# Altium schematic sheet Patil_Sheet_1_20181208.SchDoc: LED DRIVER SCHEMATIC
size B; Date: 22 OCT 2018; DrawnBy: CHINMAY PATIL; Engineer: CHINMAY PATIL; Revision: 3; SheetNumber: 1; SheetTotal: 2
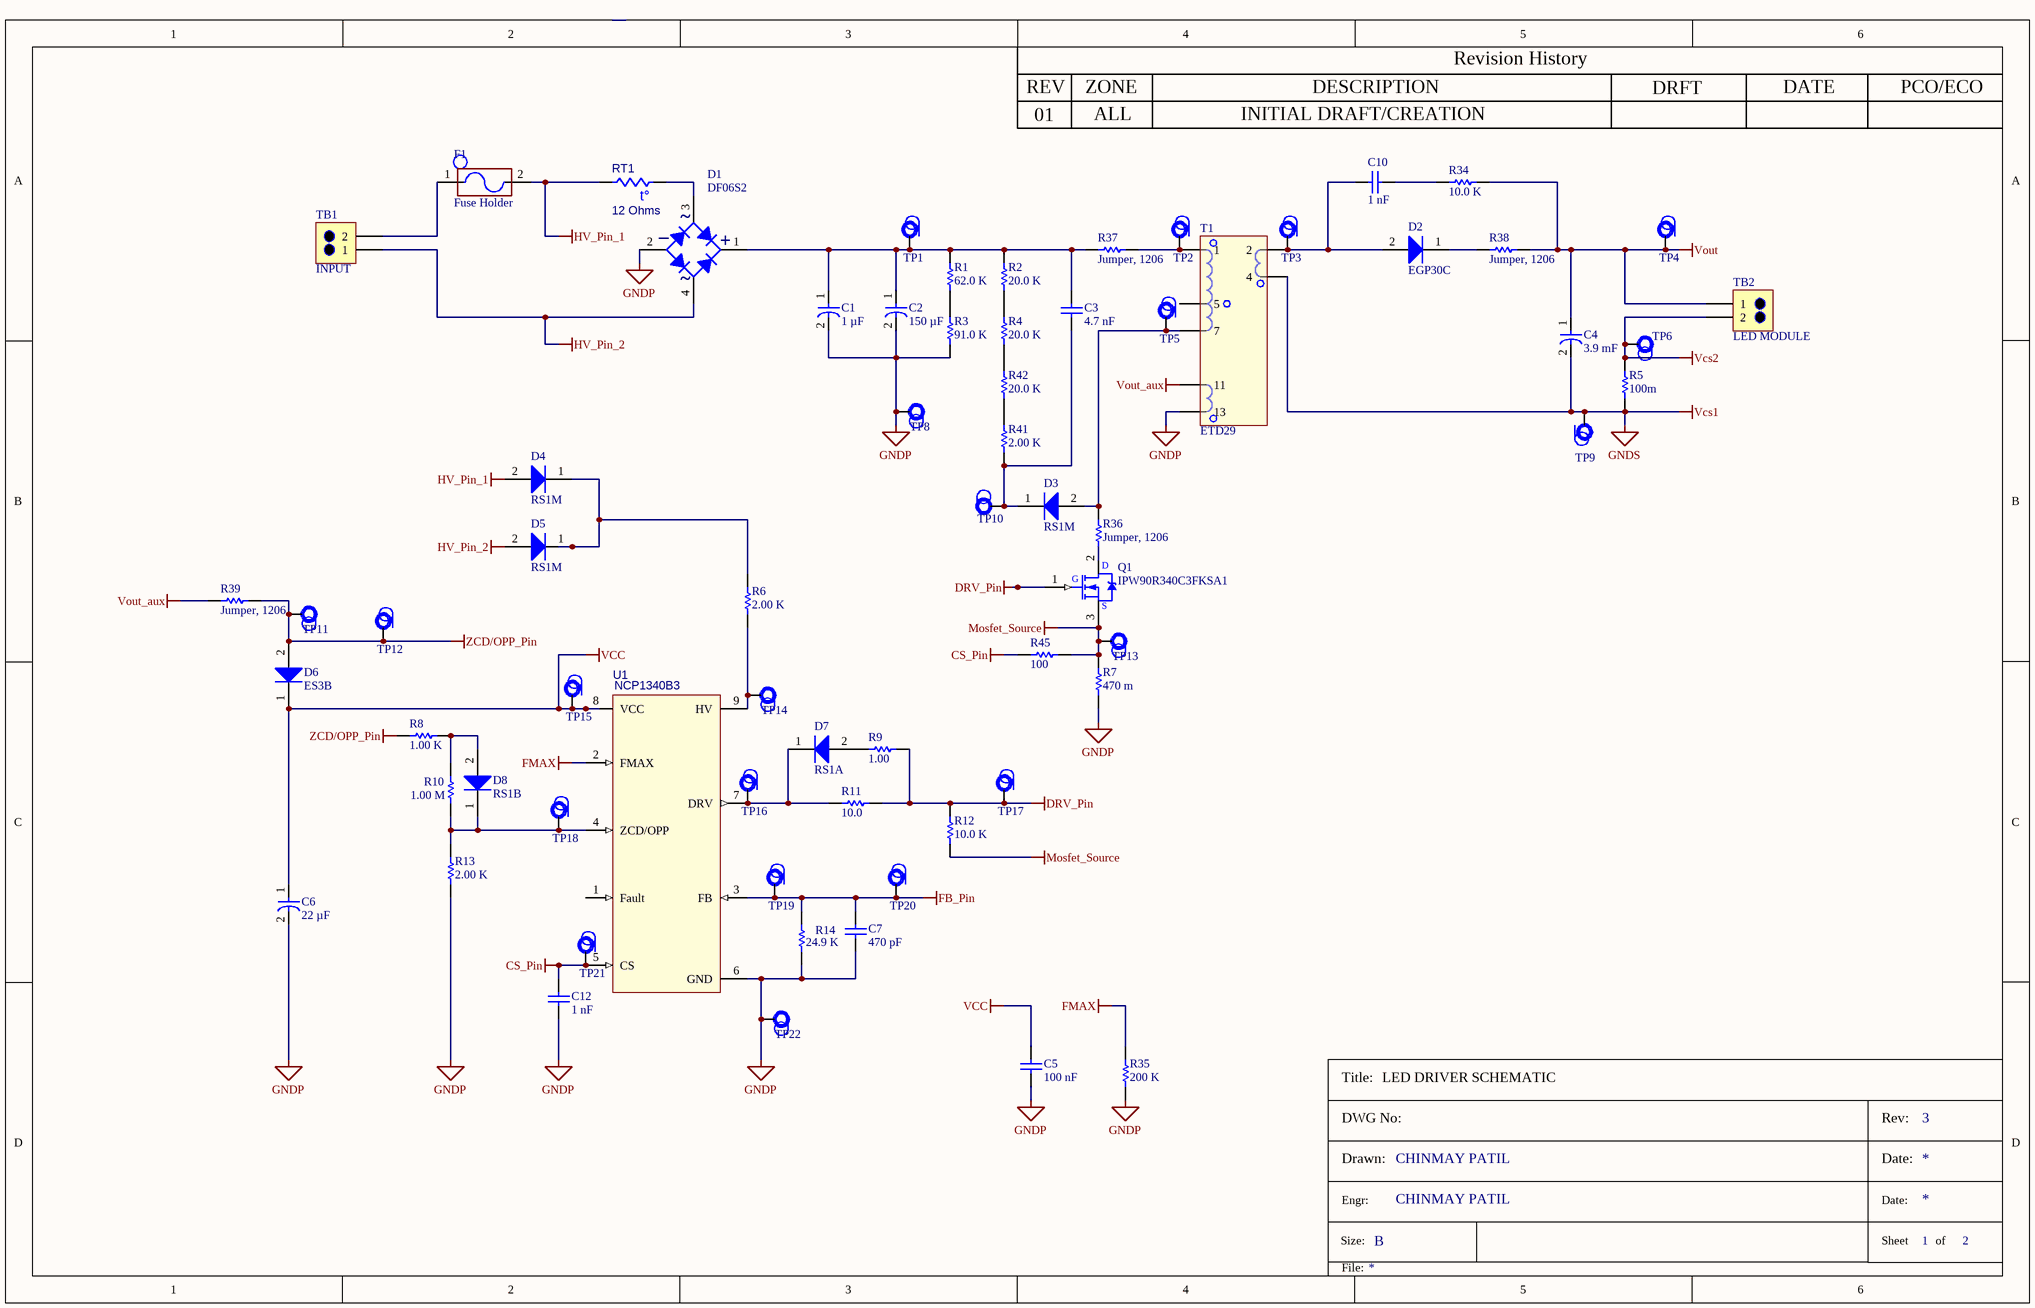
[diagram p0: Patil_Sheet_1_20181208.SchDoc]

## Parts
C1  1 µF  [CAP-RAD-THRU-L17.5 X W7.8 X LS15.0 X H11.0MM]
C2  150 µF  [CAP-SNAP_D25 X H35MM_A35]
C3  4.7 nF  [CAP-1210M_IPC]
C4  3.9 mF  [CAP-RAD-THRU-D18.0 X LS7.5 X H40.0MM]
C5  100 nF  [CAP-0805M_IPC]
C6  22 µF  [CAPAE660X540M_CASE-D_IPC]
C7  470 pF  [CAP-0805M_IPC]
C10  1 nF  [CAP-1210M_IPC]
C12  1 nF  [CAP-0805M_IPC]
D1  DF06S2  [SOIC510P1040X260-4M_IPC]
D2  EGP30C  [DIO-AXIAL-DO-201AD]
D3  RS1M  [DIODE-SMA-DO214AC]
D4  RS1M  [DIODE-SMA-DO214AC]
D5  RS1M  [DIODE-SMA-DO214AC]
D6  ES3B  [DIODE-SMC-DO214AB]
D7  RS1A  [DIODE-SMA-DO214AC]
D8  RS1B  [DIODE-SMA-DO214AC]
F1  Fuse Holder  [FUSE_HOLDER_3AG_4527]
Q1  IPW90R340C3FKSA1  [TO546P508X1588X2483-3A_IPC]
R1  62.0 K  [RES-AXIAL-2W_IPC]
R2  20.0 K  [RES-2512M_IPC]
R3  91.0 K  [RES-AXIAL-2W_IPC]
R4  20.0 K  [RES-2512M_IPC]
R5  100m  [RES-2512M_IPC]
R6  2.00 K  [RES-AXIAL-2W_IPC]
R7  470 m  [RES-2512M_IPC]
R8  1.00 K  [RES-2512M_IPC]
R9  1.00  [RES-0805M_IPC]
R10  1.00 M  [RES-1206M_IPC]
R11  10.0  [RES-0805M_IPC]
R12  10.0 K  [RES-1206M_IPC]
R13  2.00 K  [RES-2512M_IPC]
R14  24.9 K  [RES-1206M_IPC]
R34  10.0 K  [RES-2512M_IPC]
R35  200 K  [RES-1206M_IPC]
R36  Jumper, 1206  [RES-1206M_IPC]
R37  Jumper, 1206  [RES-1206M_IPC]
R38  Jumper, 1206  [RES-1206M_IPC]
R39  Jumper, 1206  [RES-1206M_IPC]
R41  2.00 K  [RES-2512M_IPC]
R42  20.0 K  [RES-2512M_IPC]
R45  100  [RES-0805M_IPC]
RT1  12 Ohms  [THERM-RADIAL-15.5MM_DIA_X6MM_THK]
T1  ETD29  [TRANS508P3530X3520X2500-13A_IPC]
TB1  INPUT  [CONN_2-POS_TERMINAL_BLOCK_1729128]
TB2  LED MODULE  [CONN_2-POS_TERMINAL_BLOCK_1729128]
TP1  Test Point  [TP_SMT_LOOP-5019_3D]  (value not drawn)
TP2  Test Point  [TP_SMT_LOOP-5019_3D]  (value not drawn)
TP3  Test Point  [TP_SMT_LOOP-5019_3D]  (value not drawn)
TP4  Test Point  [TP_SMT_LOOP-5019_3D]  (value not drawn)
TP5  Test Point  [TP_SMT_LOOP-5019_3D]  (value not drawn)
TP6  Test Point  [TP_SMT_LOOP-5019_3D]  (value not drawn)
TP8  Test Point  [TP_SMT_LOOP-5019_3D]  (value not drawn)
TP9  Test Point  [TP_SMT_LOOP-5019_3D]  (value not drawn)
TP10  Test Point  [TP_SMT_LOOP-5019_3D]  (value not drawn)
TP11  Test Point  [TP_SMT_LOOP-5019_3D]  (value not drawn)
TP12  Test Point  [TP_SMT_LOOP-5019_3D]  (value not drawn)
TP13  Test Point  [TP_SMT_LOOP-5019_3D]  (value not drawn)
TP14  Test Point  [TP_SMT_LOOP-5019_3D]  (value not drawn)
TP15  Test Point  [TP_SMT_LOOP-5019_3D]  (value not drawn)
TP16  Test Point  [TP_SMT_LOOP-5019_3D]  (value not drawn)
TP17  Test Point  [TP_SMT_LOOP-5019_3D]  (value not drawn)
TP18  Test Point  [TP_SMT_LOOP-5019_3D]  (value not drawn)
TP19  Test Point  [TP_SMT_LOOP-5019_3D]  (value not drawn)
TP20  Test Point  [TP_SMT_LOOP-5019_3D]  (value not drawn)
TP21  Test Point  [TP_SMT_LOOP-5019_3D]  (value not drawn)
TP22  Test Point  [TP_SMT_LOOP-5019_3D]  (value not drawn)
U1  NCP1340B3  [SOIC100P600X175-9M]

## Nets
CS_Pin: C12.2 R45.1 TP21.1(GND_TP) U1.5(CS)
DRV_Pin: Q1.1(GATE) R9.2 R11.2 R12.2 TP17.1(GND_TP)
FB_Pin: C7.2 R14.2 TP19.1(GND_TP) TP20.1(GND_TP) U1.3(FB)
FMAX: R35.2 U1.2(FMAX)
GNDP: C1.2(Cathode) C2.2(Cathode) C5.1 C6.2(Cathode) C7.1 C12.1 D1.2(A) R3.1 R7.1 R13.1 R14.1 R35.1 T1.13 TP8.1(GND_TP) TP22.1(GND_TP) U1.6(GND)
GNDS: C4.2(Cathode) R5.1 T1.4 TP9.1(GND_TP)  [also labelled Vcs1]
HV_Pin_1: D4.2(K) F1.2 RT1.2
HV_Pin_2: D1.4(C) D5.2(K) TB1.1
Mosfet_Source: Q1.3(SOURCE) R7.2 R12.1 R45.2 TP13.1(GND_TP)
VCC: C5.2 C6.1(Anode) D6.1(A) TP15.1(GND_TP) U1.8(VCC)
Vcs2: R5.2 TB2.2 TP6.1(GND_TP)
Vout: C4.1(Anode) R34.2 R38.1 TB2.1 TP4.1(GND_TP)
Vout_aux: R39.2 T1.11
ZCD/OPP_Pin: D6.2(K) R8.1 R39.1 TP11.1(GND_TP) TP12.1(GND_TP)
NetC1_1: C1.1(Anode) C2.1(Anode) C3.2 D1.1(K) R1.2 R2.2 R37.2 TP1.1(GND_TP)
NetC3_1: C3.1 D3.1(A) R41.1 TP10.1(GND_TP)
NetC10_1: C10.1 D2.2(K) T1.2 TP3.1(GND_TP)
NetC10_2: C10.2 R34.1
NetD1_3: D1.3(C) RT1.1
NetD2_1: D2.1(A) R38.2
NetD3_2: D3.2(K) R36.2 T1.7 TP5.1(GND_TP)
NetD4_1: D4.1(A) D5.1(A) R6.2
NetD7_1: D7.1(A) R11.1 TP16.1(GND_TP) U1.7(DRV)
NetD7_2: D7.2(K) R9.1
NetD8_1: D8.1(A) R10.2 R13.2 TP18.1(GND_TP) U1.4(ZCD/OPP)
NetD8_2: D8.2(K) R8.2 R10.1
NetF1_1: F1.1 TB1.2
NetQ1_2: Q1.2(DRAIN) R36.1
NetR1_1: R1.1 R3.2
NetR2_1: R2.1 R4.2
NetR4_1: R4.1 R42.2
NetR6_1: R6.1 TP14.1(GND_TP) U1.9(HV)
NetR37_1: R37.1 T1.1 TP2.1(GND_TP)
NetR41_2: R41.2 R42.1

Not connected (* = marked no-connect by the designer): T1 5; U1 1(Fault)

## Notes on the sheet
- REV
- ZONE
- DESCRIPTION
- Revision History
- DRFT
- DATE
- PCO/ECO
- 01
- ALL
- INITIAL DRAFT/CREATION
- Title:
- DWG No:
- Rev:
- Drawn:
- Date:
- Size:
- Engr:
- B
- Sheet
- of
- File:
- (in symbol 10-0016-002) D; G; S
- (in symbol 13-0015-001) ~; _; +
- (in symbol 15-0010-003) t°

## Library data of the parts
C1 = 16-0009-002: Capacitor, Film, 1 µF, ±5%, 450 V, Metallized Polypropylene, Radial, Lead; Manufacturer: Panasonic; Manufacturer Part Number: ECW-FD2W105J; Rated Voltage (V): 450 V; Distributor: Digi-Key; Distributor Part Number: PCF1616-ND; Package: Radial, Lead; TempCo: Metallized Polypropylene; Tolerance: ±5%; Type: Capacitor, Film; Value: 1 µF
C2 = 16-0003-003: Capacitor, Al. El., 150 µF, ±20%, 450 V, Radial, Snap; Manufacturer: Nichicon; Manufacturer Part Number: LKX2W151MESA35; Notes: A35 size; Rated Voltage (V): 450 V; Distributor: Digi-Key; Distributor Part Number: 493-17561-ND; Package: Radial, Snap; Tolerance: ±20%; Type: Capacitor, Al. El.; Value: 150 µF
C3 = 16-0010-003: Capacitor, Ceramic, 4.7 nF, ±10%, 1000 V, X7R, 1210; Manufacturer: Vishay Vitramon; Manufacturer Part Number: VJ1210Y472KXGAT5Z; Rated Voltage (V): 1000 V; Value: 4.7 nF; Tolerance: ±10%; Package: 1210; Type: Capacitor, Ceramic; TempCo: X7R; Distributor: Digi-Key; Distributor Part Number: 720-1057-1-ND
C4 = 16-0006-007: Capacitor, Al. El., 3.9 mF, ±20%, 35 V, Radial, Lead; Manufacturer: Nichicon; Manufacturer Part Number: UHE1V392MHD; Rated Voltage (V): 35 V; Distributor: Digi-Key; Distributor Part Number: 493-1602-ND; Package: Radial, Lead; Tolerance: ±20%; Type: Capacitor, Al. El.; Value: 3.9 mF
C5 = 16-0001-066: Capacitor, Ceramic, 100 nF, ±10%, 50 V, X7R, 0805; Manufacturer: TDK; Manufacturer Part Number: C2012X7R1H104KT; Rated Voltage (V): 50 V; Value: 100 nF; Tolerance: ±10%; Package: 0805; Type: Capacitor, Ceramic; TempCo: X7R; Distributor: Lab Stock; Distributor Part Number: 16-0001-066
C6 = 16-0005-007: Capacitor, Al. El., 22 µF, ±20%, 35 V, SMT; Manufacturer: Panasonic; Manufacturer Part Number: EEEFC1V220P; Notes: FC "D" Size; Rated Voltage (V): 35 V; Distributor: Digi-Key; Distributor Part Number: PCE4025CT-ND; Package: SMT; Tolerance: ±20%; Type: Capacitor, Al. El.; Value: 22 µF
C7 = 16-0001-038: Capacitor, Ceramic, 470 pF, ±5%, 50 V, NP0, 0805; Manufacturer: TDK; Manufacturer Part Number: C2012C0G1H471JT; Rated Voltage (V): 50 V; Value: 470 pF; Tolerance: ±5%; Package: 0805; Type: Capacitor, Ceramic; TempCo: NP0; Distributor: Lab Stock; Distributor Part Number: 16-0001-038
C10 = 16-0010-001: Capacitor, Ceramic, 1 nF, ±10%, 1000 V, X7R, 1210; Manufacturer: Vishay Vitramon; Manufacturer Part Number: VJ1210Y102KXGAT5Z; Rated Voltage (V): 1000 V; Value: 1 nF; Tolerance: ±10%; Package: 1210; Type: Capacitor, Ceramic; TempCo: X7R; Distributor: Digi-Key; Distributor Part Number: 720-1045-1-ND
C12 = 16-0001-042: Capacitor, Ceramic, 1 nF, ±5%, 50 V, NP0, 0805; Manufacturer: TDK; Manufacturer Part Number: C2012C0G1H102JT; Rated Voltage (V): 50 V; Value: 1 nF; Tolerance: ±5%; Package: 0805; Type: Capacitor, Ceramic; TempCo: NP0; Distributor: Lab Stock; Distributor Part Number: 16-0001-042
D1 = 13-0015-001: Diode, Bridge, Std Recovery, DF06S2, 600 V, 2 A, SDIP-4; Manufacturer: ON Semi; I or P: 2 A; Type: Diode, Schottky; V (max): 600 V; Distributor: Digi-Key; Distributor Part Number: DF06S2CT-ND; Manufacturer Part Number: DF06S2; Package: SDIP-4; Industry Number: DF06S2
D2 = 13-0023-001: Diode, Fast Recovery, EGP30C, 150 V, 3 A, DO-201AD; Manufacturer: ON Semi; I or P: 3 A; V (max): 150 V; Distributor: Digi-Key; Distributor Part Number: EGP30CCT-ND; Manufacturer Part Number: EGP30C; Package: DO-201AD, Axial; Industry Number: EGP30C; Type: Diode, Fast Recovery
D3-D5 = 13-0001-007: Diode, Fast Recovery, RS1M, 1000 V, 1 A, SMA; Manufacturer: ON Semi; I or P: 1 A; V (max): 1000 V; Distributor: Digi-Key; Distributor Part Number: RS1MFSCT-ND; Manufacturer Part Number: RS1M; Package: SMA; Industry Number: RS1M; Type: Diode, Fast Recovery
D6 = 13-0026-002: Diode, Fast Recovery, ES3B, 100 V, 3 A, SMC; Manufacturer: ON Semiconductor; I or P: 3 A; V (max): 100 V; Distributor: Digi-Key; Distributor Part Number: ES3BFSCT-ND; Manufacturer Part Number: ES3B; Package: SMC; Industry Number: ES3B; Type: Diode, Fast Recovery
D7 = 13-0001-001: Diode, Fast Recovery, RS1A, 50 V, 1 A, SMA; Manufacturer: ON Semi; I or P: 1 A; V (max): 50 V; Distributor: Digi-Key; Distributor Part Number: RS1ACT-ND; Manufacturer Part Number: RS1A; Package: SMA; Industry Number: RS1A; Type: Diode, Fast Recovery
D8 = 13-0001-002: Diode, Fast Recovery, RS1B, 100 V, 1 A, SMA; Manufacturer: ON Semi; I or P: 1 A; V (max): 100 V; Distributor: Digi-Key; Distributor Part Number: RS1BFSCT-ND; Manufacturer Part Number: RS1B; Package: SMA; Industry Number: RS1B; Type: Diode, Fast Recovery
F1 = 18-0012-001: Fuse Holder, TH, 5mm, 3AG; Manufacturer: Keystone Electronics; Manufacturer Part Number: 4527; Package: TH; Industry Name: Fuse Holder; Type: 5mm; Mounting Type: 3AG; Distributor: Digi-Key; Distributor Part Number: 36-4527-ND
Q1 = 10-0016-002: MOSFET, N-Channel, IPW90R340C3FKSA1, 900 V, 340 mOhm, TO-247; Manufacturer: Infineon; Vce/ds (max): 900 V; Current/ Resistance Description: 340 mOhm; Distributor: Digi-Key; Distributor Part Number: IPW90R340C3FKSA1-ND; Industry Number: IPW90R340C3FKSA1; Mfr Part Number: IPW90R340C3FKSA1; Package: TO-247; Notes: *; Polarity: N-Channel; Type: MOSFET
R1 = 15-0005-124: Resistor, TH, 62.0 K, 5%, 2 W, MO, Axial; Manufacturer: Yageo; Manufacturer Part Number: RSF200JB-73-62K; Rated Power (W): 2 W; Composition: MO; Distributor: Digi-Key; Distributor Part Number: 62KW-2-ND; Package: Axial; Tolerance: 5%; Type: Resistor, TH; Value: 62.0 K
R2 R4 R42 = 15-0004-129: Resistor, SMT, 20.0 K, 5%, 1 W, 2512; Rated Power (W): 1 W; Distributor: Lab Stock; Distributor Part Number: 15-0004-129; Package: 2512; Tolerance: 5%; Type: Resistor, SMT; Value: 20.0 K
R3 = 15-0005-128: Resistor, TH, 91.0 K, 5%, 2 W, MO, Axial; Manufacturer: Yageo; Manufacturer Part Number: RSF200JB-73-91K; Rated Power (W): 2 W; Composition: MO; Distributor: Digi-Key; Distributor Part Number: 91KW-2-ND; Package: Axial; Tolerance: 5%; Type: Resistor, TH; Value: 91.0 K
R5 = 15-0012-001: Resistor, SMT, 100m, 1%, 1 W, 2512; Manufacturer: Yageo; Manufacturer Part Number: RL2512FK-070R1L; Rated Power (W): 1 W; Distributor: Digi-Key; Distributor Part Number: 311-0.1TCT-ND; Package: 2512; Tolerance: 1%; Type: Resistor, SMT; Value: 100m
R6 = 15-0005-088: Resistor, TH, 2.00 K, 5%, 2 W, MO, Axial; Manufacturer: Yageo; Manufacturer Part Number: RSF200JB-73-2K; Rated Power (W): 2 W; Composition: MO; Distributor: Digi-Key; Distributor Part Number: 2.0KW-2-ND; Package: Axial; Tolerance: 5%; Type: Resistor, TH; Value: 2.00 K
R7 = 15-0012-003: Resistor, SMT, 470 m, 1%, 1 W, 2512; Manufacturer: Yageo; Manufacturer Part Number: RL2512FK-070R47L; Rated Power (W): 1 W; Distributor: Digi-Key; Distributor Part Number: 311-0.47TCT-ND; Package: 2512; Tolerance: 1%; Type: Resistor, SMT; Value: 470 m
R8 = 15-0004-098: Resistor, SMT, 1.00 K, 5%, 1 W, 2512; Rated Power (W): 1 W; Distributor: Lab Stock; Distributor Part Number: 15-0004-098; Package: 2512; Tolerance: 5%; Type: Resistor, SMT; Value: 1.00 K
R9 = 15-0002-001: Resistor, SMT, 1.00, 1%, 125 mW, 0805; Manufacturer: Yageo; Rated Power (W): 125 mW; Value: 1.00; Tolerance: 1%; Package: 0805; Type: Resistor, SMT; Distributor: Lab Stock; Distributor Part Number: 15-0002-001
R10 = 15-0003-577: Resistor, SMT, 1.00 M, 1%, 250 mW, 1206; Manufacturer: Yageo; Rated Power (W): 250 mW; Distributor: Lab Stock; Distributor Part Number: 15-0003-577; Package: 1206; Tolerance: 1%; Type: Resistor, SMT; Value: 1.00 M
R11 = 15-0002-097: Resistor, SMT, 10.0, 1%, 125 mW, 0805; Manufacturer: Yageo; Rated Power (W): 125 mW; Distributor: Lab Stock; Distributor Part Number: 15-0002-097; Package: 0805; Tolerance: 1%; Type: Resistor, SMT; Value: 10.0
R12 = 15-0003-385: Resistor, SMT, 10.0 K, 1%, 250 mW, 1206; Manufacturer: Yageo; Rated Power (W): 250 mW; Distributor: Lab Stock; Distributor Part Number: 15-0003-385; Package: 1206; Tolerance: 1%; Type: Resistor, SMT; Value: 10.0 K
R13 R41 = 15-0004-105: Resistor, SMT, 2.00 K, 5%, 1 W, 2512; Rated Power (W): 1 W; Distributor: Lab Stock; Distributor Part Number: 15-0004-105; Package: 2512; Tolerance: 5%; Type: Resistor, SMT; Value: 2.00 K
R14 = 15-0003-423: Resistor, SMT, 24.9 K, 1%, 250 mW, 1206; Manufacturer: Yageo; Rated Power (W): 250 mW; Distributor: Lab Stock; Distributor Part Number: 15-0003-423; Package: 1206; Tolerance: 1%; Type: Resistor, SMT; Value: 24.9 K
R34 = 15-0004-122: Resistor, SMT, 10.0 K, 5%, 1 W, 2512; Rated Power (W): 1 W; Distributor: Lab Stock; Distributor Part Number: 15-0004-122; Package: 2512; Tolerance: 5%; Type: Resistor, SMT; Value: 10.0 K
R35 = 15-0003-510: Resistor, SMT, 200 K, 1%, 250 mW, 1206; Manufacturer: Yageo; Rated Power (W): 250 mW; Distributor: Lab Stock; Distributor Part Number: 15-0003-510; Package: 1206; Tolerance: 1%; Type: Resistor, SMT; Value: 200 K
R36-R39 = 15-0001-002: Package: 0805
R45 = 15-0002-193: Resistor, SMT, 100, 1%, 125 mW, 0805; Manufacturer: Yageo; Rated Power (W): 125 mW; Distributor: Lab Stock; Distributor Part Number: 15-0002-193; Package: 0805; Tolerance: 1%; Type: Resistor, SMT; Value: 100
RT1 = 15-0010-003: Inrush Limiter, 12 Ohms, ±20%, 3 A, 15.5 mm, Radial; Manufacturer: Cantherm; Manufacturer Part Number: MF72-012D13; Rated Power (W): 3 A; Composition: 15.5 mm; Distributor: Digi-Key; Distributor Part Number: 317-1200-ND; Package: Radial; Tolerance: ±20%; Type: Inrush Limiter; Value: 12 Ohms
T1 = 17-0002-002: Bobbin, ETD29, Horzontal, 13 Pins; Manufacturer: TDK/EPCOS; Manufacturer Part Number: B66359X1014T001; Pins-Type-Color: 13 Pins; Core Type: Bobbin; Current Max: *; Distributor: Digi-Key; Distributor Part Number: 495-5455-ND; Insulation: *; Mounting: Horzontal; Notes: *; Package: ETD29
TB1 TB2 = 18-0008-001: Terminal Block, 2 Pos., Vertical, 14-30 AWG, 5.08 mm; Manufacturer: Phoenix Contact; Manufacturer Part Number: 1729128; Package: 2 Pos.; Color: 5.08 mm; Industry Name: Terminal Block; Type: Vertical; Mounting Type: 14-30 AWG; Distributor: Digi-Key; Distributor Part Number: 277-1247-ND
TP1-TP6 TP8-TP22 = 18-0011-002: Test Point, SMT, Miniature; Manufacturer: Keystone Electronics; Manufacturer Part Number: 5019; Package: SMT; Type: Miniature; Mounting Type: Surface Mount; Industry Name: Test Point; Distributor: Digi-Key; Distributor Part Number: 36-5019CT-ND
U1 = 11-0021-001: Controller, PWM, NCP1340B3, SOIC-9; Manufacturer: On Semi; Mfr Part Number: NCP1340B3D1R2G; Distributor: Digi-Key; Distributor Part Number: NCP1340B3D1R2GOSCT-ND; Function: Controller, PWM; Industry Number: NCP1340B3; Package: SOIC-9